# Altium schematic sheet Jetson Nano Power-one.SchDoc
size A
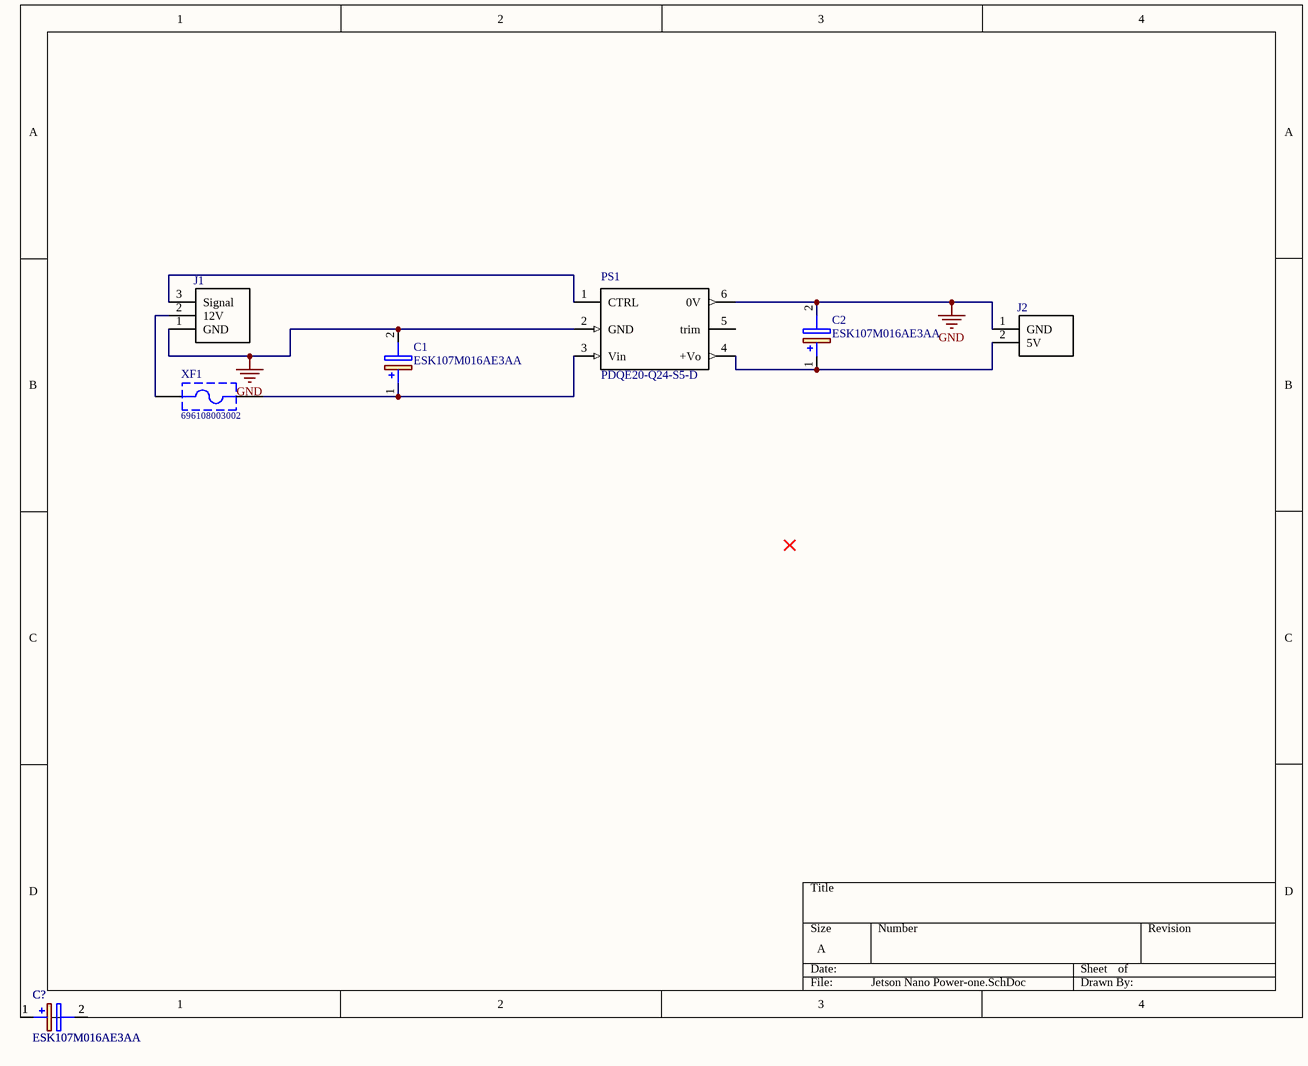
[diagram p0: Jetson Nano Power-one.SchDoc]

## Parts
(Parts that share a designator on the sheet are numbered #1, #2 ... from top to bottom, then left to right.)
C1  ESK107M016AE3AA  [CAPPRD250W50D630H1250]
C2  ESK107M016AE3AA  [CAPPRD250W50D630H1250]
C?#1  ESK107M016AE3AA  [CAPPRD250W50D630H1250]
C?#2  ESK107M016AE3AA  [CAPPRD250W50D630H1250]
J1  282856-3  [*TE_282856-3]  (value not drawn)
J2  282856-2  [*TE_282856-2]  (value not drawn)
PS1  PDQE20-Q24-S5-D  [*CONV_PDQE20-Q24-S5-D]
XF1  696108003002  [696108003002]

## Nets
GND: C1.2(-) C2.2(-) J1.1(GND) J2.1(GND) PS1.2(GND) PS1.6(0V)
NetC1_1: C1.1(+) PS1.3(Vin) XF1.2
NetC2_1: C2.1(+) J2.2(5V) PS1.4(+Vo)
NetC?#1_1: C?#1.1(+) C?#2.1(+)
NetC?#1_2: C?#1.2(-) C?#2.2(-)
NetJ1_2: J1.2(12V) XF1.1
NetJ1_3: J1.3(Signal) PS1.1(CTRL)

Not connected (* = marked no-connect by the designer): PS1 5(trim)

## Library data of the parts
C1 C2 C?#1 C?#2 = ESK107M016AE3AA: Capacitor Polarised; Manufacturer_Name: Kemet; Datasheet Link: https://api.kemet.com/component-edge/download/datasheet/ESK107M016AE3AA.pdf; Height: 12.5mm; Manufacturer_Part_Number: ESK107M016AE3AA
J1 = 282856-3: TERMI-BLOK PCB MOUNT 3P; MF: TE Connectivity; MP: 282856-3; SnapEDA_Link: https://www.snapeda.com/parts/282856-3/TE%20Connectivity%20AMP%20Connectors/view-part/2383467/?ref=snap; EU_RoHS_Compliance: Compliant with Exemptions; TE_purchase_URL: https://www.te.com/usa-en/product-282856-3.html?te_bu=Cor&te_type=disp&te_campaign=seda_glo_cor-seda-global-disp-prtnr-fy19-seda-model-bom-cta_sma-317_1&elqCampaignId=32493; Package: None; Digi-Key_Part_Number: A98356-ND; Digi-Key_Purchase_URL: https://www.digikey.com/product-detail/en/te-connectivity-amp-connectors/282856-3/A98356-ND/1131587?utm_source=snapeda&utm_medium=aggregator&utm_campaign=symbol; Value: *
J2 = 282856-2: TERMI-BLOK PCB MOUNT 2P; MF: TE Connectivity; TE_purchase_URL: https://www.te.com/usa-en/product-282856-2.html?te_bu=Cor&te_type=disp&te_campaign=seda_glo_cor-seda-global-disp-prtnr-fy19-seda-model-bom-cta_sma-317_1&elqCampaignId=32493; Price: None; MP: 282856-2; SnapEDA_Link: https://www.snapeda.com/parts/282856-2/TE%20Connectivity%20AMP%20Connectors/view-part/1809079/?ref=snap; EU_RoHS_Compliance: Compliant with Exemptions; Package: None; Availability: Unavailable; Value: *
PS1 = PDQE20-Q24-S5-D: 20 W, 4:1 Input Range, Single/Dual Regulated Output, DIP, 1500 Vdc Isolation, Dc-Dc Converter; MF: CUI Inc.; Digi-Key_Purchase_URL: https://www.digikey.com/product-detail/en/cui-inc/PDQE20-Q24-S5-D/102-6267-ND/10230156?utm_source=snapeda&utm_medium=aggregator&utm_campaign=symbol; CUI_purchase_URL: https://www.cui.com/product/dc-dc-converters/isolated/pdqe20-d-series?utm_source=snapeda.com&utm_medium=referral&utm_campaign=snapedaBOM; Digi-Key_Part_Number: 102-6267-ND; Package: DIP-6 CUI Inc.; SnapEDA_Link: https://www.snapeda.com/parts/PDQE20-Q24-S5-D/CUI/view-part/3740268/?ref=snap; MP: PDQE20-Q24-S5-D; Value: *
XF1 = CMP-1502-00237-1: WR-FSH Fuse Holder Blocks Fuse Holder Blocks Clip Cover for PCB; Manufacturer: Wurth Elektronik; Fuse Size: 5x20mm; Operating Temperature: -30to120degC; Datasheet URL: https://katalog.we-online.de/em/datasheet/696108003002.pdf; Mounting Technology: THT; Package Reference: 696108003002; Part Number: 696108003002; Manufacturer URL: http://www.we-online.de; Packaging: Box; Publisher: WurthElektronik